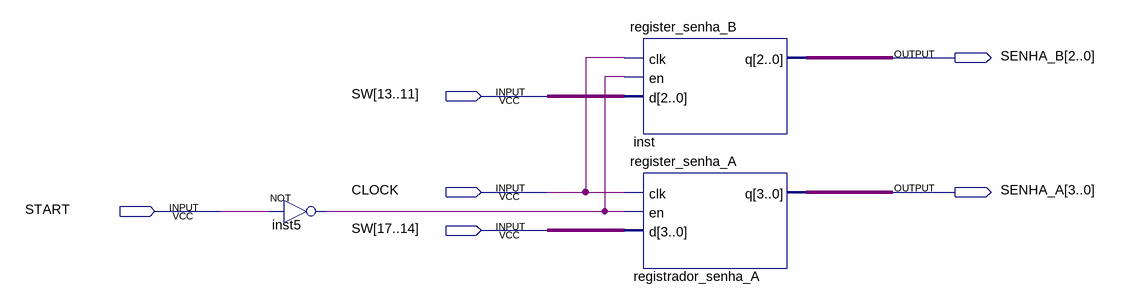
[diagram p0: schematic sheet]
// Quartus schematic armazena_senha.bdf as structural Verilog: 3 symbols, 6 pins
module armazena_senha (
  input  [17:11] SW,
  input  CLOCK,
  input  START,
  output [2:0] SENHA_B,
  output [3:0] SENHA_A
);

  wire inst5_out;

  not inst5 (inst5_out, START);
  register_senha_B inst (.clk(CLOCK), .en(inst5_out), .d(SW[13:11]), .q(SENHA_B));
  register_senha_A registrador_senha_A (.clk(CLOCK), .en(inst5_out), .d(SW[17:14]), .q(SENHA_A));
endmodule
